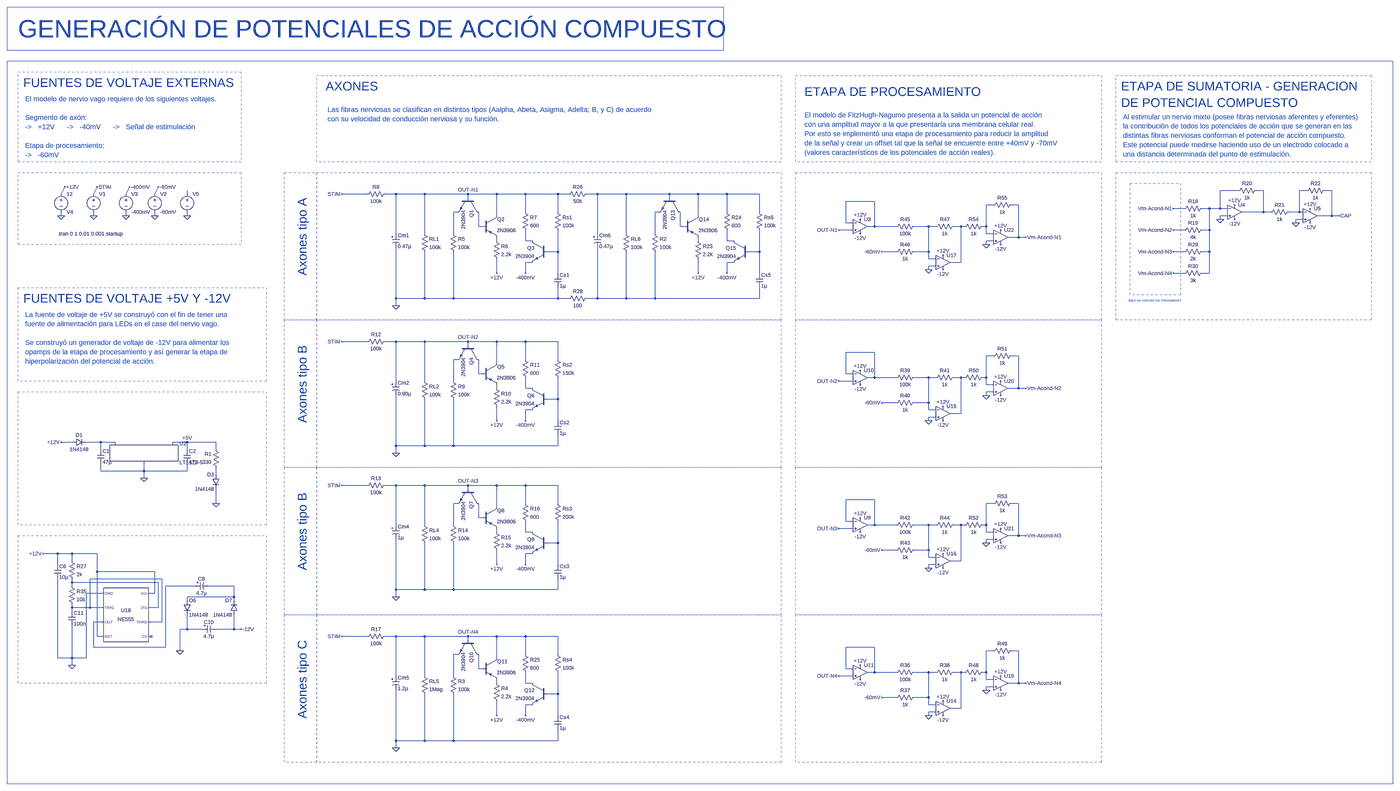
[diagram p0: schematic Compound-Action-Potential.asc, whole sheet]
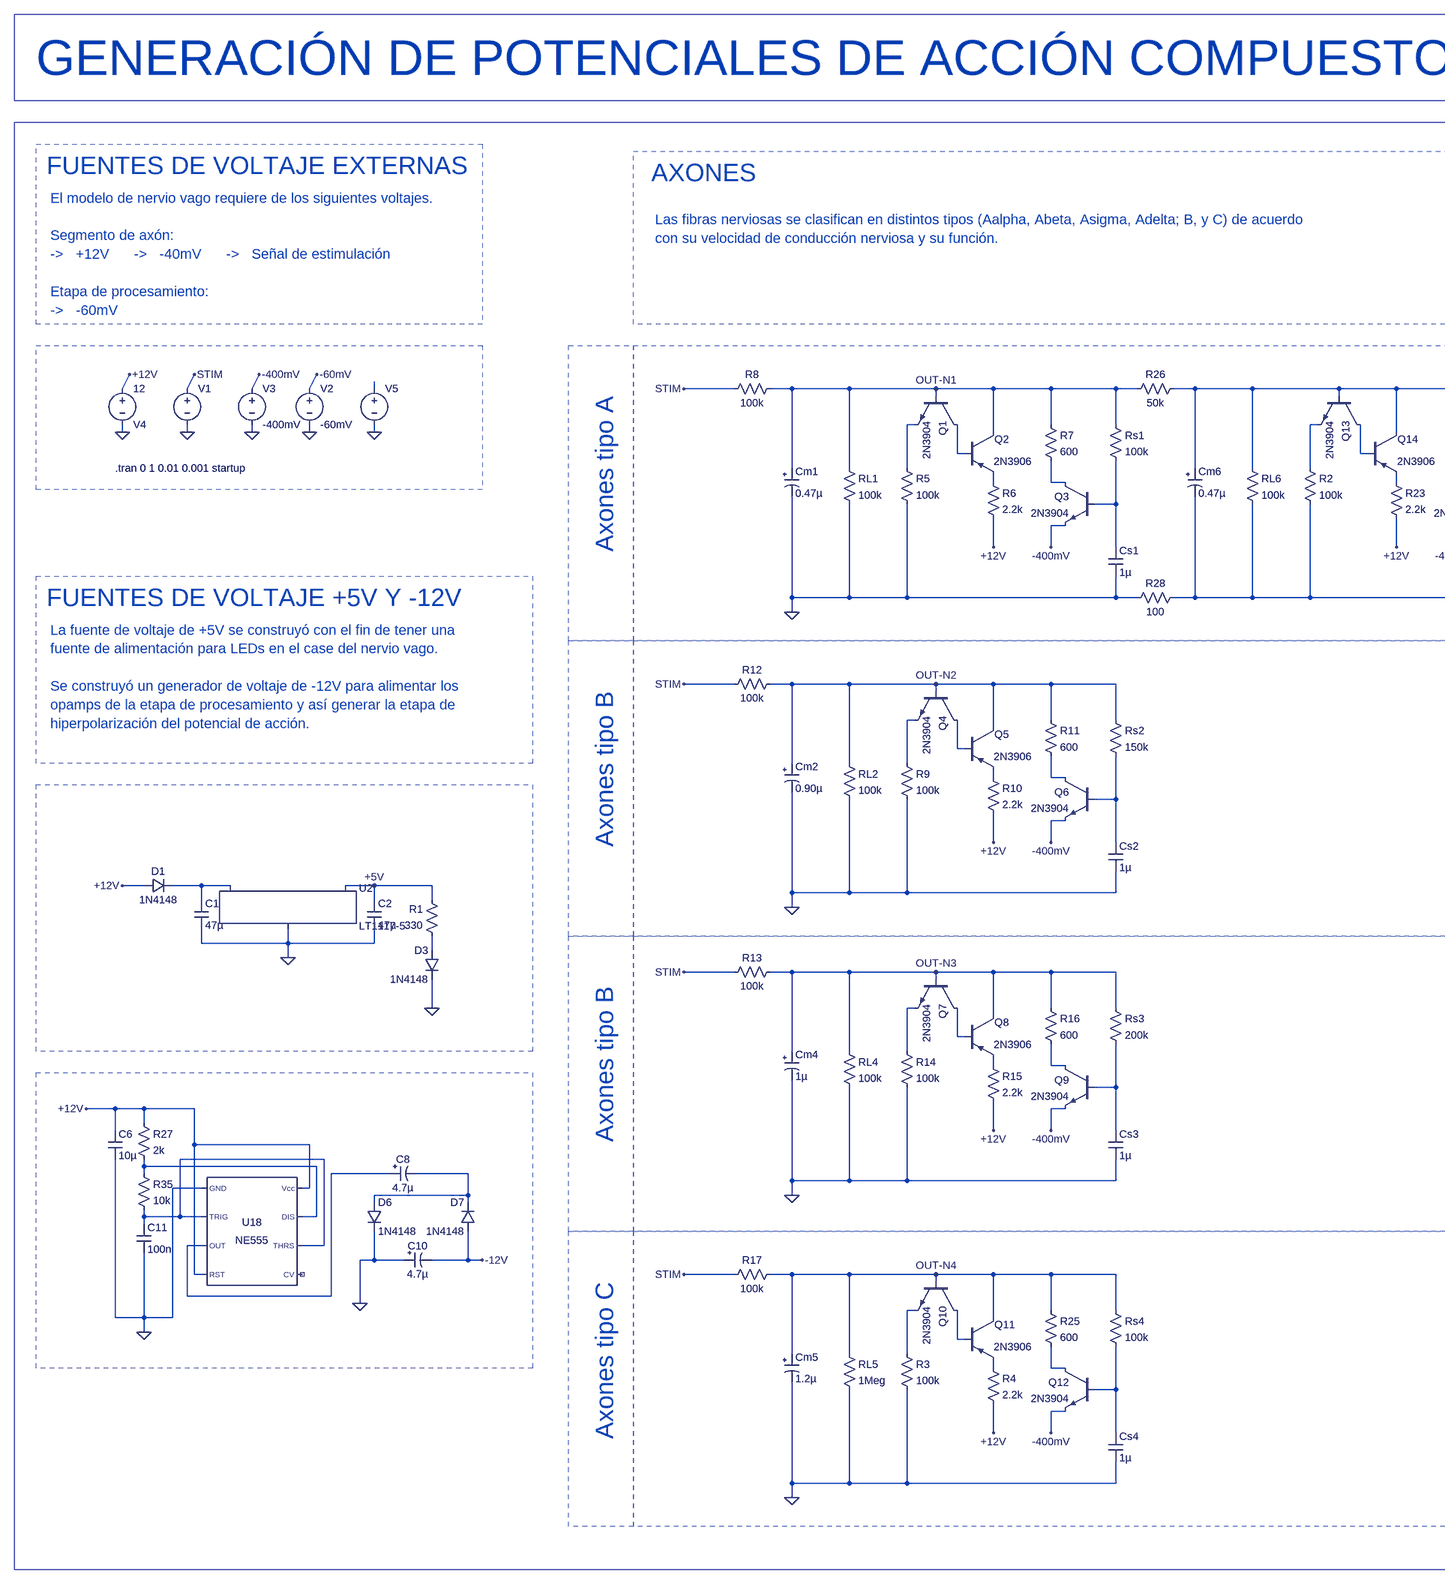
[diagram p1: schematic Compound-Action-Potential.asc, part, row 1 of 1, column 1 of 2]
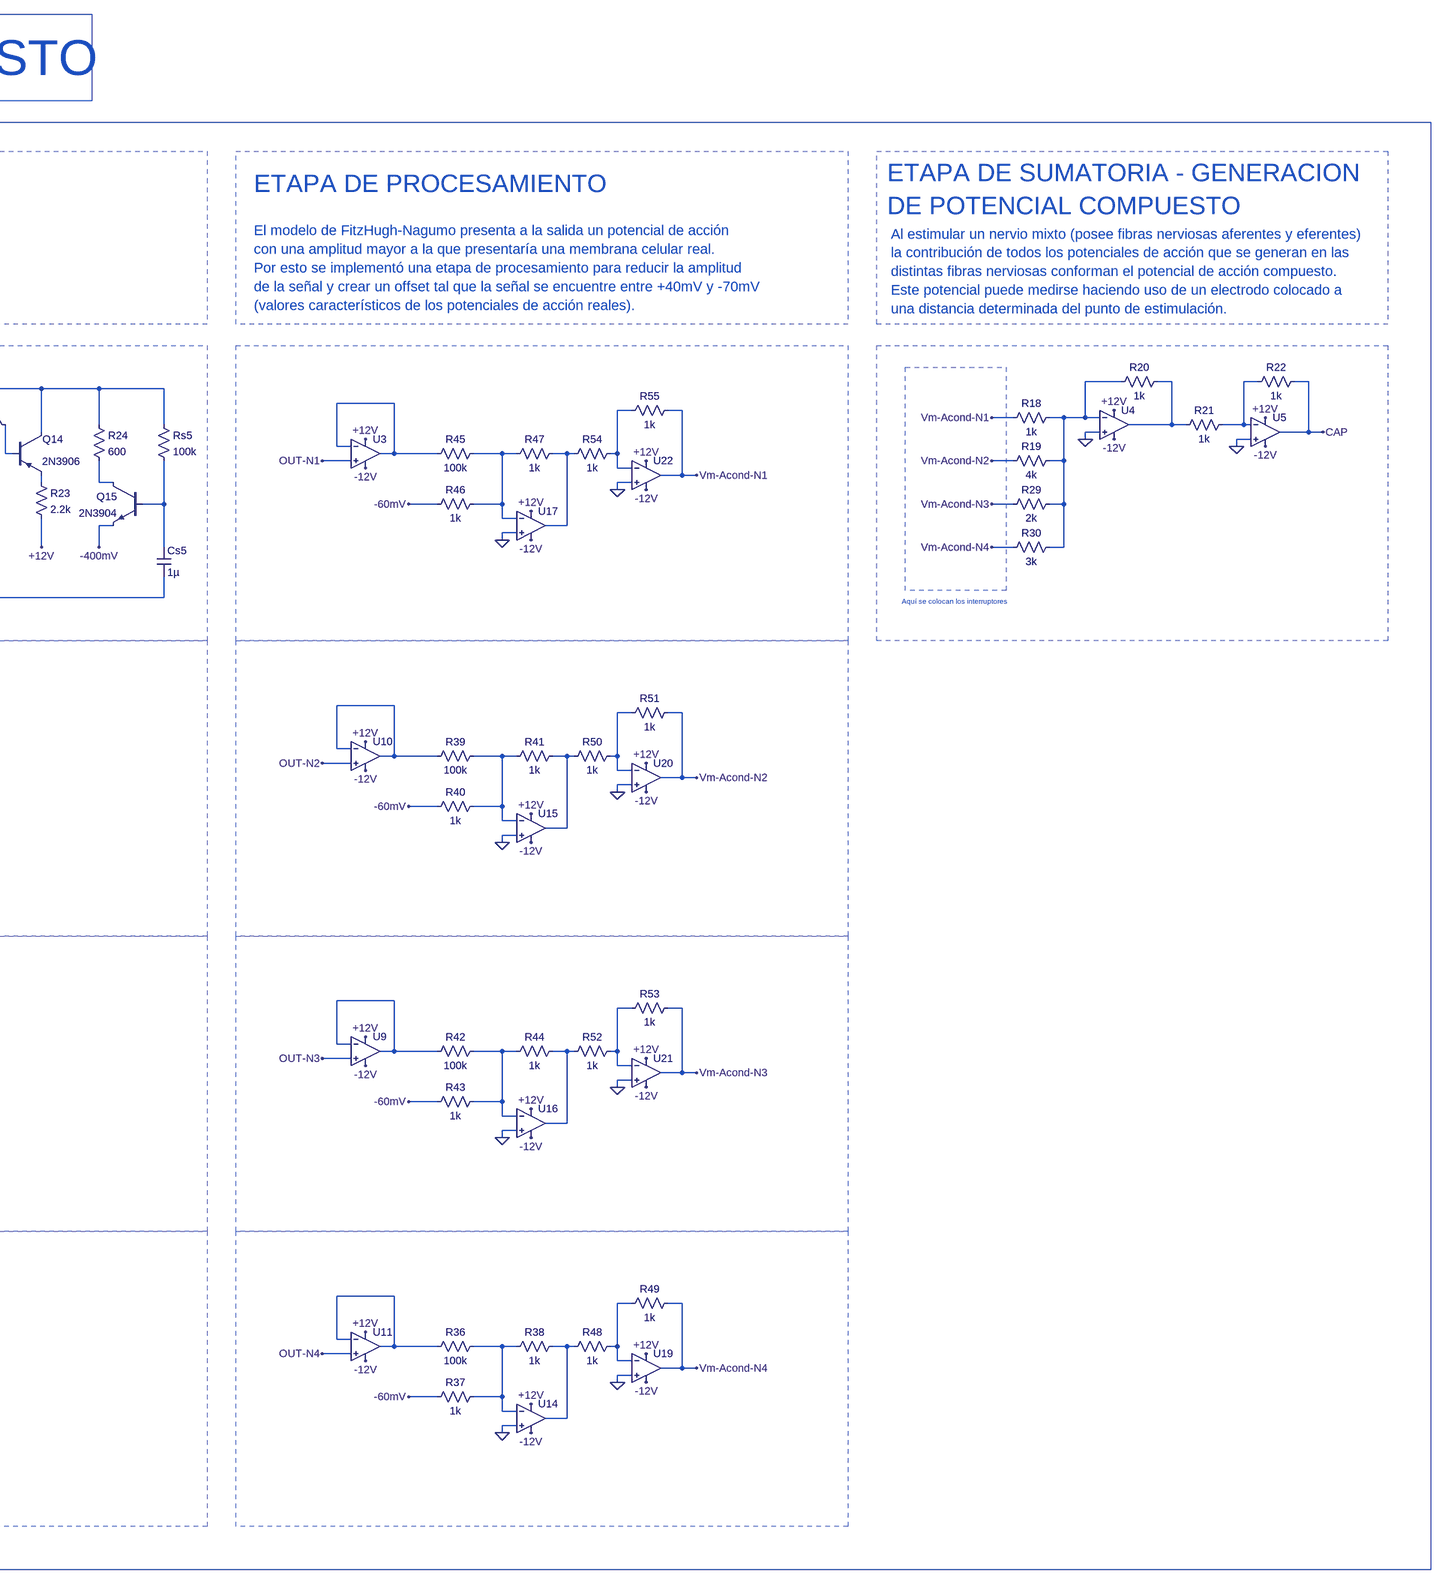
[diagram p2: schematic Compound-Action-Potential.asc, part, row 1 of 1, column 2 of 2]
Compound-Action-Potential.asc, the LTspice schematic file:
Version 4
SHEET 1 6660 4644
WIRE 4304 1152 4224 1152
WIRE 4416 1152 4384 1152
WIRE 4608 1152 4576 1152
WIRE 4720 1152 4688 1152
WIRE -928 1168 -912 1136
WIRE -784 1168 -768 1136
WIRE -640 1168 -624 1136
WIRE -512 1168 -496 1136
WIRE -368 1168 -368 1152
WIRE 432 1168 320 1168
WIRE 560 1168 512 1168
WIRE 688 1168 560 1168
WIRE 880 1168 688 1168
WIRE 1008 1168 880 1168
WIRE 1136 1168 1008 1168
WIRE 1280 1168 1136 1168
WIRE 1328 1168 1280 1168
WIRE 1456 1168 1408 1168
WIRE 1584 1168 1456 1168
WIRE 1776 1168 1584 1168
WIRE 1904 1168 1776 1168
WIRE 2032 1168 1904 1168
WIRE 2176 1168 2032 1168
WIRE 880 1184 880 1168
WIRE 1776 1184 1776 1168
WIRE 2688 1200 2560 1200
WIRE 3216 1216 3184 1216
WIRE 3328 1216 3296 1216
WIRE 4064 1232 4016 1232
WIRE 4176 1232 4144 1232
WIRE 4224 1232 4224 1152
WIRE 4224 1232 4176 1232
WIRE 4256 1232 4224 1232
WIRE 832 1248 816 1248
WIRE 1136 1248 1136 1168
WIRE 1280 1248 1280 1168
WIRE 1728 1248 1712 1248
WIRE 2032 1248 2032 1168
WIRE 2176 1248 2176 1168
WIRE 4416 1248 4416 1152
WIRE 4416 1248 4320 1248
WIRE 4448 1248 4416 1248
WIRE 4576 1248 4576 1152
WIRE 4576 1248 4528 1248
WIRE 4592 1248 4576 1248
WIRE -928 1264 -928 1248
WIRE -784 1264 -784 1248
WIRE -640 1264 -640 1248
WIRE -512 1264 -512 1248
WIRE -368 1264 -368 1248
WIRE 1008 1264 1008 1168
WIRE 1904 1264 1904 1168
WIRE 4256 1264 4224 1264
WIRE 4720 1264 4720 1152
WIRE 4720 1264 4656 1264
WIRE 4752 1264 4720 1264
WIRE 4224 1280 4224 1264
WIRE 4592 1280 4560 1280
WIRE 2560 1296 2560 1200
WIRE 2592 1296 2560 1296
WIRE 4560 1296 4560 1280
WIRE 928 1312 928 1248
WIRE 944 1312 928 1312
WIRE 1824 1312 1824 1248
WIRE 1840 1312 1824 1312
WIRE 2688 1312 2688 1200
WIRE 2688 1312 2656 1312
WIRE 2784 1312 2688 1312
WIRE 2928 1312 2864 1312
WIRE 2960 1312 2928 1312
WIRE 3072 1312 3040 1312
WIRE 3088 1312 3072 1312
WIRE 3184 1312 3184 1216
WIRE 3184 1312 3168 1312
WIRE 2592 1328 2528 1328
WIRE 4064 1328 4016 1328
WIRE 4176 1328 4176 1232
WIRE 4176 1328 4144 1328
WIRE 560 1344 560 1168
WIRE 688 1344 688 1168
WIRE 816 1344 816 1248
WIRE 1456 1344 1456 1168
WIRE 1584 1344 1584 1168
WIRE 1712 1344 1712 1248
WIRE 3184 1344 3184 1312
WIRE 3216 1344 3184 1344
WIRE 3328 1360 3328 1216
WIRE 3328 1360 3280 1360
WIRE 3360 1360 3328 1360
WIRE 1008 1376 1008 1360
WIRE 1136 1376 1136 1328
WIRE 1168 1376 1136 1376
WIRE 1904 1376 1904 1360
WIRE 2032 1376 2032 1328
WIRE 2064 1376 2032 1376
WIRE 3216 1376 3184 1376
WIRE 3184 1392 3184 1376
WIRE 1280 1424 1280 1328
WIRE 1280 1424 1232 1424
WIRE 2176 1424 2176 1328
WIRE 2176 1424 2128 1424
WIRE 2784 1424 2720 1424
WIRE 2928 1424 2928 1312
WIRE 2928 1424 2864 1424
WIRE 4064 1424 4016 1424
WIRE 4176 1424 4176 1328
WIRE 4176 1424 4144 1424
WIRE 2928 1456 2928 1424
WIRE 2960 1456 2928 1456
WIRE 1168 1472 1136 1472
WIRE 2064 1472 2032 1472
WIRE 3072 1472 3072 1312
WIRE 3072 1472 3024 1472
WIRE 2960 1488 2928 1488
WIRE 2928 1504 2928 1488
WIRE 1008 1520 1008 1456
WIRE 1136 1520 1136 1472
WIRE 1280 1520 1280 1424
WIRE 1904 1520 1904 1456
WIRE 2032 1520 2032 1472
WIRE 2176 1520 2176 1424
WIRE 4064 1520 4016 1520
WIRE 4176 1520 4176 1424
WIRE 4176 1520 4144 1520
WIRE 560 1632 560 1408
WIRE 688 1632 688 1424
WIRE 688 1632 560 1632
WIRE 816 1632 816 1424
WIRE 816 1632 688 1632
WIRE 1280 1632 1280 1584
WIRE 1280 1632 816 1632
WIRE 1328 1632 1280 1632
WIRE 1456 1632 1456 1408
WIRE 1456 1632 1408 1632
WIRE 1584 1632 1584 1424
WIRE 1584 1632 1456 1632
WIRE 1712 1632 1712 1424
WIRE 1712 1632 1584 1632
WIRE 2176 1632 2176 1584
WIRE 2176 1632 1712 1632
WIRE 560 1664 560 1632
WIRE 432 1824 320 1824
WIRE 560 1824 512 1824
WIRE 688 1824 560 1824
WIRE 880 1824 688 1824
WIRE 1008 1824 880 1824
WIRE 1136 1824 1008 1824
WIRE 1280 1824 1136 1824
WIRE 880 1840 880 1824
WIRE 2688 1872 2560 1872
WIRE 3216 1888 3184 1888
WIRE 3328 1888 3296 1888
WIRE 832 1904 816 1904
WIRE 1136 1904 1136 1824
WIRE 1280 1904 1280 1824
WIRE 1008 1920 1008 1824
WIRE 928 1968 928 1904
WIRE 944 1968 928 1968
WIRE 2560 1968 2560 1872
WIRE 2592 1968 2560 1968
WIRE 2688 1984 2688 1872
WIRE 2688 1984 2656 1984
WIRE 2784 1984 2688 1984
WIRE 2928 1984 2864 1984
WIRE 2960 1984 2928 1984
WIRE 3072 1984 3040 1984
WIRE 3088 1984 3072 1984
WIRE 3184 1984 3184 1888
WIRE 3184 1984 3168 1984
WIRE 560 2000 560 1824
WIRE 688 2000 688 1824
WIRE 816 2000 816 1904
WIRE 2592 2000 2528 2000
WIRE 3184 2016 3184 1984
WIRE 3216 2016 3184 2016
WIRE 1008 2032 1008 2016
WIRE 1136 2032 1136 1984
WIRE 1168 2032 1136 2032
WIRE 3328 2032 3328 1888
WIRE 3328 2032 3280 2032
WIRE 3360 2032 3328 2032
WIRE 3216 2048 3184 2048
WIRE 3184 2064 3184 2048
WIRE 1280 2080 1280 1984
WIRE 1280 2080 1232 2080
WIRE 2784 2096 2720 2096
WIRE 2928 2096 2928 1984
WIRE 2928 2096 2864 2096
WIRE 1168 2128 1136 2128
WIRE 2928 2128 2928 2096
WIRE 2960 2128 2928 2128
WIRE 3072 2144 3072 1984
WIRE 3072 2144 3024 2144
WIRE 2960 2160 2928 2160
WIRE 1008 2176 1008 2112
WIRE 1136 2176 1136 2128
WIRE 1280 2176 1280 2080
WIRE 2928 2176 2928 2160
WIRE -880 2272 -928 2272
WIRE -752 2272 -816 2272
WIRE -688 2272 -752 2272
WIRE -368 2272 -432 2272
WIRE -240 2272 -368 2272
WIRE 560 2288 560 2064
WIRE 688 2288 688 2080
WIRE 688 2288 560 2288
WIRE 816 2288 816 2080
WIRE 816 2288 688 2288
WIRE 1280 2288 1280 2240
WIRE 1280 2288 816 2288
WIRE -752 2304 -752 2272
WIRE -368 2304 -368 2272
WIRE -240 2304 -240 2272
WIRE 560 2320 560 2288
WIRE -752 2400 -752 2368
WIRE -560 2400 -560 2368
WIRE -560 2400 -752 2400
WIRE -368 2400 -368 2368
WIRE -368 2400 -560 2400
WIRE -240 2416 -240 2384
WIRE -560 2432 -560 2400
WIRE 432 2464 320 2464
WIRE 560 2464 512 2464
WIRE 688 2464 560 2464
WIRE 880 2464 688 2464
WIRE 1008 2464 880 2464
WIRE 1136 2464 1008 2464
WIRE 1280 2464 1136 2464
WIRE 880 2480 880 2464
WIRE 2688 2528 2560 2528
WIRE -240 2544 -240 2480
WIRE 832 2544 816 2544
WIRE 1136 2544 1136 2464
WIRE 1280 2544 1280 2464
WIRE 3216 2544 3184 2544
WIRE 3328 2544 3296 2544
WIRE 1008 2560 1008 2464
WIRE 928 2608 928 2544
WIRE 944 2608 928 2608
WIRE 2560 2624 2560 2528
WIRE 2592 2624 2560 2624
WIRE 560 2640 560 2464
WIRE 688 2640 688 2464
WIRE 816 2640 816 2544
WIRE 2688 2640 2688 2528
WIRE 2688 2640 2656 2640
WIRE 2784 2640 2688 2640
WIRE 2928 2640 2864 2640
WIRE 2960 2640 2928 2640
WIRE 3072 2640 3040 2640
WIRE 3088 2640 3072 2640
WIRE 3184 2640 3184 2544
WIRE 3184 2640 3168 2640
WIRE 2592 2656 2528 2656
WIRE 1008 2672 1008 2656
WIRE 1136 2672 1136 2624
WIRE 1168 2672 1136 2672
WIRE 3184 2672 3184 2640
WIRE 3216 2672 3184 2672
WIRE 3328 2688 3328 2544
WIRE 3328 2688 3280 2688
WIRE 3360 2688 3328 2688
WIRE 3216 2704 3184 2704
WIRE 1280 2720 1280 2624
WIRE 1280 2720 1232 2720
WIRE 3184 2720 3184 2704
WIRE 2784 2752 2720 2752
WIRE 2928 2752 2928 2640
WIRE 2928 2752 2864 2752
WIRE -944 2768 -1008 2768
WIRE -880 2768 -944 2768
WIRE -768 2768 -880 2768
WIRE 1168 2768 1136 2768
WIRE 2928 2784 2928 2752
WIRE 2960 2784 2928 2784
WIRE -880 2800 -880 2768
WIRE 3072 2800 3072 2640
WIRE 3072 2800 3024 2800
WIRE -944 2816 -944 2768
WIRE 1008 2816 1008 2752
WIRE 1136 2816 1136 2768
WIRE 1280 2816 1280 2720
WIRE 2960 2816 2928 2816
WIRE 2928 2832 2928 2816
WIRE -768 2848 -768 2768
WIRE -512 2848 -768 2848
WIRE -480 2880 -800 2880
WIRE -880 2896 -880 2880
WIRE -496 2896 -880 2896
WIRE -880 2912 -880 2896
WIRE -336 2912 -464 2912
WIRE -160 2912 -272 2912
WIRE 560 2928 560 2704
WIRE 688 2928 688 2720
WIRE 688 2928 560 2928
WIRE 816 2928 816 2720
WIRE 816 2928 688 2928
WIRE 1280 2928 1280 2880
WIRE 1280 2928 816 2928
WIRE -752 2944 -816 2944
WIRE -512 2944 -512 2848
WIRE -512 2944 -528 2944
WIRE -160 2960 -160 2912
WIRE -160 2960 -368 2960
WIRE 560 2960 560 2928
WIRE -368 2976 -368 2960
WIRE -160 2976 -160 2960
WIRE -880 3008 -880 2992
WIRE -800 3008 -800 2880
WIRE -800 3008 -880 3008
WIRE -752 3008 -800 3008
WIRE -496 3008 -496 2896
WIRE -496 3008 -528 3008
WIRE -880 3024 -880 3008
WIRE -752 3072 -784 3072
WIRE -480 3072 -480 2880
WIRE -480 3072 -528 3072
WIRE -368 3104 -368 3040
WIRE -368 3104 -400 3104
WIRE -304 3104 -368 3104
WIRE -160 3104 -160 3040
WIRE -160 3104 -240 3104
WIRE -128 3104 -160 3104
WIRE -768 3136 -768 2848
WIRE -752 3136 -768 3136
WIRE 432 3136 320 3136
WIRE 560 3136 512 3136
WIRE 688 3136 560 3136
WIRE 880 3136 688 3136
WIRE 1008 3136 880 3136
WIRE 1136 3136 1008 3136
WIRE 1280 3136 1136 3136
WIRE 880 3152 880 3136
WIRE -784 3184 -784 3072
WIRE -464 3184 -464 2912
WIRE -464 3184 -784 3184
WIRE 2688 3184 2560 3184
WIRE -400 3200 -400 3104
WIRE 3216 3200 3184 3200
WIRE 3328 3200 3296 3200
WIRE 832 3216 816 3216
WIRE 1136 3216 1136 3136
WIRE 1280 3216 1280 3136
WIRE -944 3232 -944 2880
WIRE -880 3232 -880 3088
WIRE -880 3232 -944 3232
WIRE -816 3232 -816 2944
WIRE -816 3232 -880 3232
WIRE 1008 3232 1008 3136
WIRE -880 3264 -880 3232
WIRE 928 3280 928 3216
WIRE 944 3280 928 3280
WIRE 2560 3280 2560 3184
WIRE 2592 3280 2560 3280
WIRE 2688 3296 2688 3184
WIRE 2688 3296 2656 3296
WIRE 2784 3296 2688 3296
WIRE 2928 3296 2864 3296
WIRE 2960 3296 2928 3296
WIRE 3072 3296 3040 3296
WIRE 3088 3296 3072 3296
WIRE 3184 3296 3184 3200
WIRE 3184 3296 3168 3296
WIRE 560 3312 560 3136
WIRE 688 3312 688 3136
WIRE 816 3312 816 3216
WIRE 2592 3312 2528 3312
WIRE 3184 3328 3184 3296
WIRE 3216 3328 3184 3328
WIRE 1008 3344 1008 3328
WIRE 1136 3344 1136 3296
WIRE 1168 3344 1136 3344
WIRE 3328 3344 3328 3200
WIRE 3328 3344 3280 3344
WIRE 3360 3344 3328 3344
WIRE 3216 3360 3184 3360
WIRE 3184 3376 3184 3360
WIRE 1280 3392 1280 3296
WIRE 1280 3392 1232 3392
WIRE 2784 3408 2720 3408
WIRE 2928 3408 2928 3296
WIRE 2928 3408 2864 3408
WIRE 1168 3440 1136 3440
WIRE 2928 3440 2928 3408
WIRE 2960 3440 2928 3440
WIRE 3072 3456 3072 3296
WIRE 3072 3456 3024 3456
WIRE 2960 3472 2928 3472
WIRE 1008 3488 1008 3424
WIRE 1136 3488 1136 3440
WIRE 1280 3488 1280 3392
WIRE 2928 3488 2928 3472
WIRE 560 3600 560 3376
WIRE 688 3600 688 3392
WIRE 688 3600 560 3600
WIRE 816 3600 816 3392
WIRE 816 3600 688 3600
WIRE 1280 3600 1280 3552
WIRE 1280 3600 816 3600
WIRE 560 3632 560 3600
FLAG -560 2432 0
FLAG -240 2544 0
FLAG -368 2272 +5V
FLAG 560 1664 0
FLAG -640 1264 0
FLAG -624 1136 -400mV
FLAG -928 2272 +12V
FLAG 1008 1520 +12V
FLAG 1136 1520 -400mV
FLAG -368 1264 0
FLAG 560 2320 0
FLAG 1008 2176 +12V
FLAG 1136 2176 -400mV
FLAG 880 1168 OUT-N1
FLAG 880 1824 OUT-N2
FLAG 560 2960 0
FLAG 1008 2816 +12V
FLAG 1136 2816 -400mV
FLAG 880 2464 OUT-N3
FLAG 4224 1280 0
FLAG -912 1136 +12V
FLAG 4288 1216 +12V
FLAG 4288 1280 -12V
FLAG 4624 1232 +12V
FLAG 4624 1296 -12V
FLAG 4560 1296 0
FLAG 4752 1264 CAP
FLAG 2624 1344 -12V
FLAG 2624 1280 +12V
FLAG 2528 1328 OUT-N1
FLAG 2624 2672 -12V
FLAG 2624 2608 +12V
FLAG 2528 2656 OUT-N3
FLAG 2624 2016 -12V
FLAG 2624 1952 +12V
FLAG 2528 2000 OUT-N2
FLAG 2624 3328 -12V
FLAG 2624 3264 +12V
FLAG 2528 3312 OUT-N4
FLAG 560 3632 0
FLAG 1008 3488 +12V
FLAG 1136 3488 -400mV
FLAG 880 3136 OUT-N4
FLAG -784 1264 0
FLAG -768 1136 STIM
FLAG 2928 3488 0
FLAG 2928 2176 0
FLAG 2928 2832 0
FLAG 2928 1504 0
FLAG 2992 3424 +12V
FLAG 2992 2112 +12V
FLAG 2992 2768 +12V
FLAG 2992 1440 +12V
FLAG 2992 3488 -12V
FLAG 2992 2176 -12V
FLAG 2992 2832 -12V
FLAG 2992 1504 -12V
FLAG 3184 3376 0
FLAG 3248 3312 +12V
FLAG 3248 3376 -12V
FLAG 3184 2064 0
FLAG 3248 2000 +12V
FLAG 3248 2064 -12V
FLAG 3184 2720 0
FLAG 3248 2656 +12V
FLAG 3248 2720 -12V
FLAG 3184 1392 0
FLAG 3248 1328 +12V
FLAG 3248 1392 -12V
FLAG -880 3264 0
FLAG -400 3200 0
FLAG -1008 2768 +12V
FLAG 2720 1424 -60mV
FLAG 2720 2752 -60mV
FLAG 2720 2096 -60mV
FLAG 2720 3408 -60mV
FLAG 3360 1360 Vm-Acond-N1
FLAG 3360 2032 Vm-Acond-N2
FLAG 3360 2688 Vm-Acond-N3
FLAG 3360 3344 Vm-Acond-N4
FLAG 4016 1232 Vm-Acond-N1
FLAG 4016 1328 Vm-Acond-N2
FLAG 4016 1424 Vm-Acond-N3
FLAG 4016 1520 Vm-Acond-N4
FLAG -928 1264 0
FLAG -512 1264 0
FLAG -496 1136 -60mV
FLAG -128 3104 -12V
FLAG 320 1168 STIM
FLAG 320 1824 STIM
FLAG 320 2464 STIM
FLAG 320 3136 STIM
FLAG 1904 1520 +12V
FLAG 2032 1520 -400mV
SYMBOL PowerProducts\\LT1117-5 -560 2272 R0
SYMATTR InstName U2
SYMBOL diode -880 2288 R270
WINDOW 0 32 32 VTop 2
WINDOW 3 0 32 VBottom 2
SYMATTR InstName D1
SYMATTR Value 1N4148
SYMBOL diode -224 2416 M0
SYMATTR InstName D3
SYMATTR Value 1N4148
SYMBOL res -224 2400 R180
WINDOW 0 36 76 Left 2
WINDOW 3 36 40 Left 2
SYMATTR InstName R1
SYMATTR Value 330
SYMBOL res 672 1328 R0
SYMATTR InstName RL1
SYMATTR Value 100k
SYMBOL res 800 1328 R0
SYMATTR InstName R5
SYMATTR Value 100k
SYMBOL res 992 1360 R0
SYMATTR InstName R6
SYMATTR Value 2.2k
SYMBOL res 1264 1232 R0
SYMATTR InstName Rs1
SYMATTR Value 100k
SYMBOL cap 1264 1520 R0
SYMATTR InstName Cs1
SYMATTR Value 1µ
SYMBOL npn 928 1184 R90
SYMATTR InstName Q1
SYMATTR Value 2N3904
SYMBOL pnp 944 1264 R0
WINDOW 0 66 16 Left 2
WINDOW 3 65 65 Left 2
SYMATTR InstName Q2
SYMATTR Value 2N3906
SYMBOL npn 1232 1376 M0
SYMATTR InstName Q3
SYMATTR Value 2N3904
SYMBOL polcap 544 1344 R0
SYMATTR InstName Cm1
SYMATTR Value 0.47µ
SYMBOL res 1120 1232 R0
SYMATTR InstName R7
SYMATTR Value 600
SYMBOL voltage -640 1152 R0
WINDOW 123 0 0 Left 0
WINDOW 39 0 0 Left 0
SYMATTR InstName V3
SYMATTR Value -400mV
SYMBOL cap -768 2304 R0
SYMATTR InstName C1
SYMATTR Value 47µ
SYMBOL cap -384 2304 R0
SYMATTR InstName C2
SYMATTR Value 47µ
SYMBOL voltage -368 1152 R0
WINDOW 123 0 0 Left 0
WINDOW 39 0 0 Left 0
WINDOW 3 24 44 Invisible 2
SYMATTR Value PWL(0 0 5m 0 5.0000001m 0.5 15m 0.5 15.000001m 0 70m 0 70.000001m 1 80m 1 80.000001m 0 135m 0 135.000001m 2 145m 2 145.000001m 0 200m 0 200.000001m 3 210m 3 210.000001m 0 265m 0 265.000001m 4 275m 4 275.000001m 0 330m 0 330.00001m 5 340m 5 340.000001m 0)
SYMATTR InstName V5
SYMBOL res 672 1984 R0
SYMATTR InstName RL2
SYMATTR Value 100k
SYMBOL res 800 1984 R0
SYMATTR InstName R9
SYMATTR Value 100k
SYMBOL res 992 2016 R0
SYMATTR InstName R10
SYMATTR Value 2.2k
SYMBOL res 1264 1888 R0
SYMATTR InstName Rs2
SYMATTR Value 150k
SYMBOL cap 1264 2176 R0
SYMATTR InstName Cs2
SYMATTR Value 1µ
SYMBOL npn 928 1840 R90
SYMATTR InstName Q4
SYMATTR Value 2N3904
SYMBOL pnp 944 1920 R0
WINDOW 0 66 16 Left 2
WINDOW 3 65 65 Left 2
SYMATTR InstName Q5
SYMATTR Value 2N3906
SYMBOL npn 1232 2032 M0
SYMATTR InstName Q6
SYMATTR Value 2N3904
SYMBOL polcap 544 2000 R0
SYMATTR InstName Cm2
SYMATTR Value 0.90µ
SYMBOL res 1120 1888 R0
SYMATTR InstName R11
SYMATTR Value 600
SYMBOL res 672 2624 R0
SYMATTR InstName RL4
SYMATTR Value 100k
SYMBOL res 800 2624 R0
SYMATTR InstName R14
SYMATTR Value 100k
SYMBOL res 992 2656 R0
SYMATTR InstName R15
SYMATTR Value 2.2k
SYMBOL res 1264 2528 R0
SYMATTR InstName Rs3
SYMATTR Value 200k
SYMBOL cap 1264 2816 R0
SYMATTR InstName Cs3
SYMATTR Value 1µ
SYMBOL npn 928 2480 R90
SYMATTR InstName Q7
SYMATTR Value 2N3904
SYMBOL pnp 944 2560 R0
WINDOW 0 66 16 Left 2
WINDOW 3 65 65 Left 2
SYMATTR InstName Q8
SYMATTR Value 2N3906
SYMBOL npn 1232 2672 M0
SYMATTR InstName Q9
SYMATTR Value 2N3904
SYMBOL polcap 544 2640 R0
SYMATTR InstName Cm4
SYMATTR Value 1µ
SYMBOL res 1120 2528 R0
SYMATTR InstName R16
SYMATTR Value 600
SYMBOL res 4160 1216 R90
WINDOW 0 0 56 VBottom 2
WINDOW 3 32 56 VTop 2
SYMATTR InstName R18
SYMATTR Value 1k
SYMBOL res 4160 1312 R90
WINDOW 0 0 56 VBottom 2
WINDOW 3 32 56 VTop 2
SYMATTR InstName R19
SYMATTR Value 4k
SYMBOL res 4400 1136 R90
WINDOW 0 0 56 VBottom 2
WINDOW 3 32 56 VTop 2
SYMATTR InstName R20
SYMATTR Value 1k
SYMBOL OpAmps\\UniversalOpAmp2 4288 1248 R0
SYMATTR InstName U4
SYMBOL voltage -928 1152 R0
WINDOW 0 24 96 Left 2
WINDOW 3 24 16 Left 2
WINDOW 123 0 0 Left 0
WINDOW 39 0 0 Left 0
SYMATTR InstName V4
SYMATTR Value 12
SYMBOL OpAmps\\UniversalOpAmp2 4624 1264 R0
SYMATTR InstName U5
SYMBOL res 4544 1232 R90
WINDOW 0 0 56 VBottom 2
WINDOW 3 32 56 VTop 2
SYMATTR InstName R21
SYMATTR Value 1k
SYMBOL res 4704 1136 R90
WINDOW 0 0 56 VBottom 2
WINDOW 3 32 56 VTop 2
SYMATTR InstName R22
SYMATTR Value 1k
SYMBOL res 4160 1408 R90
WINDOW 0 0 56 VBottom 2
WINDOW 3 32 56 VTop 2
SYMATTR InstName R29
SYMATTR Value 2k
SYMBOL res 4160 1504 R90
WINDOW 0 0 56 VBottom 2
WINDOW 3 32 56 VTop 2
SYMATTR InstName R30
SYMATTR Value 3k
SYMBOL OpAmps\\UniversalOpAmp2 2624 1312 R0
SYMATTR InstName U3
SYMBOL OpAmps\\UniversalOpAmp2 2624 2640 R0
SYMATTR InstName U9
SYMBOL OpAmps\\UniversalOpAmp2 2624 1984 R0
SYMATTR InstName U10
SYMBOL OpAmps\\UniversalOpAmp2 2624 3296 R0
SYMATTR InstName U11
SYMBOL res 672 3296 R0
SYMATTR InstName RL5
SYMATTR Value 1Meg
SYMBOL res 800 3296 R0
SYMATTR InstName R3
SYMATTR Value 100k
SYMBOL res 992 3328 R0
SYMATTR InstName R4
SYMATTR Value 2.2k
SYMBOL res 1264 3200 R0
SYMATTR InstName Rs4
SYMATTR Value 100k
SYMBOL cap 1264 3488 R0
SYMATTR InstName Cs4
SYMATTR Value 1µ
SYMBOL npn 928 3152 R90
SYMATTR InstName Q10
SYMATTR Value 2N3904
SYMBOL pnp 944 3232 R0
WINDOW 0 66 16 Left 2
WINDOW 3 65 65 Left 2
SYMATTR InstName Q11
SYMATTR Value 2N3906
SYMBOL npn 1232 3344 M0
SYMATTR InstName Q12
SYMATTR Value 2N3904
SYMBOL polcap 544 3312 R0
SYMATTR InstName Cm5
SYMATTR Value 1.2µ
SYMBOL res 1120 3200 R0
SYMATTR InstName R25
SYMATTR Value 600
SYMBOL voltage -784 1152 R0
WINDOW 123 0 0 Left 0
WINDOW 39 0 0 Left 0
WINDOW 3 24 44 Invisible 2
SYMATTR Value PULSE(0 5 0 1f 1f 10m 140m 0)
SYMATTR InstName V1
SYMBOL OpAmps\\UniversalOpAmp 2992 3456 R0
SYMATTR InstName U14
SYMBOL res 2880 3280 R90
WINDOW 0 0 56 VBottom 2
WINDOW 3 32 56 VTop 2
SYMATTR InstName R36
SYMATTR Value 100k
SYMBOL res 2880 3392 R90
WINDOW 0 0 56 VBottom 2
WINDOW 3 32 56 VTop 2
SYMATTR InstName R37
SYMATTR Value 1k
SYMBOL res 3056 3280 R90
WINDOW 0 0 56 VBottom 2
WINDOW 3 32 56 VTop 2
SYMATTR InstName R38
SYMATTR Value 1k
SYMBOL OpAmps\\UniversalOpAmp 2992 2144 R0
SYMATTR InstName U15
SYMBOL res 2880 1968 R90
WINDOW 0 0 56 VBottom 2
WINDOW 3 32 56 VTop 2
SYMATTR InstName R39
SYMATTR Value 100k
SYMBOL res 2880 2080 R90
WINDOW 0 0 56 VBottom 2
WINDOW 3 32 56 VTop 2
SYMATTR InstName R40
SYMATTR Value 1k
SYMBOL res 3056 1968 R90
WINDOW 0 0 56 VBottom 2
WINDOW 3 32 56 VTop 2
SYMATTR InstName R41
SYMATTR Value 1k
SYMBOL OpAmps\\UniversalOpAmp 2992 2800 R0
SYMATTR InstName U16
SYMBOL res 2880 2624 R90
WINDOW 0 0 56 VBottom 2
WINDOW 3 32 56 VTop 2
SYMATTR InstName R42
SYMATTR Value 100k
SYMBOL res 2880 2736 R90
WINDOW 0 0 56 VBottom 2
WINDOW 3 32 56 VTop 2
SYMATTR InstName R43
SYMATTR Value 1k
SYMBOL res 3056 2624 R90
WINDOW 0 0 56 VBottom 2
WINDOW 3 32 56 VTop 2
SYMATTR InstName R44
SYMATTR Value 1k
SYMBOL OpAmps\\UniversalOpAmp 2992 1472 R0
SYMATTR InstName U17
SYMBOL res 2880 1296 R90
WINDOW 0 0 56 VBottom 2
WINDOW 3 32 56 VTop 2
SYMATTR InstName R45
SYMATTR Value 100k
SYMBOL res 2880 1408 R90
WINDOW 0 0 56 VBottom 2
WINDOW 3 32 56 VTop 2
SYMATTR InstName R46
SYMATTR Value 1k
SYMBOL res 3056 1296 R90
WINDOW 0 0 56 VBottom 2
WINDOW 3 32 56 VTop 2
SYMATTR InstName R47
SYMATTR Value 1k
SYMBOL OpAmps\\UniversalOpAmp 3248 3344 R0
SYMATTR InstName U19
SYMBOL res 3184 3280 R90
WINDOW 0 0 56 VBottom 2
WINDOW 3 32 56 VTop 2
SYMATTR InstName R48
SYMATTR Value 1k
SYMBOL res 3312 3184 R90
WINDOW 0 0 56 VBottom 2
WINDOW 3 32 56 VTop 2
SYMATTR InstName R49
SYMATTR Value 1k
SYMBOL OpAmps\\UniversalOpAmp 3248 2032 R0
SYMATTR InstName U20
SYMBOL res 3184 1968 R90
WINDOW 0 0 56 VBottom 2
WINDOW 3 32 56 VTop 2
SYMATTR InstName R50
SYMATTR Value 1k
SYMBOL res 3312 1872 R90
WINDOW 0 0 56 VBottom 2
WINDOW 3 32 56 VTop 2
SYMATTR InstName R51
SYMATTR Value 1k
SYMBOL OpAmps\\UniversalOpAmp 3248 2688 R0
SYMATTR InstName U21
SYMBOL res 3184 2624 R90
WINDOW 0 0 56 VBottom 2
WINDOW 3 32 56 VTop 2
SYMATTR InstName R52
SYMATTR Value 1k
SYMBOL res 3312 2528 R90
WINDOW 0 0 56 VBottom 2
WINDOW 3 32 56 VTop 2
SYMATTR InstName R53
SYMATTR Value 1k
SYMBOL OpAmps\\UniversalOpAmp 3248 1360 R0
SYMATTR InstName U22
SYMBOL res 3184 1296 R90
WINDOW 0 0 56 VBottom 2
WINDOW 3 32 56 VTop 2
SYMATTR InstName R54
SYMATTR Value 1k
SYMBOL res 3312 1200 R90
WINDOW 0 0 56 VBottom 2
WINDOW 3 32 56 VTop 2
SYMATTR InstName R55
SYMATTR Value 1k
SYMBOL Misc\\NE555 -640 3040 R0
SYMATTR InstName U18
SYMBOL res -896 2784 R0
SYMATTR InstName R27
SYMATTR Value 2k
SYMBOL res -896 2896 R0
SYMATTR InstName R35
SYMATTR Value 10k
SYMBOL cap -960 2816 R0
SYMATTR InstName C6
SYMATTR Value 10µ
SYMBOL polcap -336 2896 M90
WINDOW 0 0 32 VBottom 2
WINDOW 3 32 32 VTop 2
SYMATTR InstName C8
SYMATTR Value 4.7µ
SYMBOL polcap -304 3088 M90
WINDOW 0 0 32 VBottom 2
WINDOW 3 32 32 VTop 2
SYMATTR InstName C10
SYMATTR Value 4.7µ
SYMBOL diode -384 2976 R0
SYMATTR InstName D6
SYMATTR Value 1N4148
SYMBOL diode -144 3040 R180
WINDOW 0 24 64 Left 2
WINDOW 3 24 0 Left 2
SYMATTR InstName D7
SYMATTR Value 1N4148
SYMBOL cap -896 3024 R0
SYMATTR InstName C11
SYMATTR Value 100n
SYMBOL voltage -512 1152 R0
WINDOW 123 0 0 Left 0
WINDOW 39 0 0 Left 0
SYMATTR InstName V2
SYMATTR Value -60mV
SYMBOL res 528 1152 R90
WINDOW 0 0 56 VBottom 2
WINDOW 3 32 56 VTop 2
SYMATTR InstName R8
SYMATTR Value 100k
SYMBOL res 528 1808 R90
WINDOW 0 0 56 VBottom 2
WINDOW 3 32 56 VTop 2
SYMATTR InstName R12
SYMATTR Value 100k
SYMBOL res 528 2448 R90
WINDOW 0 0 56 VBottom 2
WINDOW 3 32 56 VTop 2
SYMATTR InstName R13
SYMATTR Value 100k
SYMBOL res 528 3120 R90
WINDOW 0 0 56 VBottom 2
WINDOW 3 32 56 VTop 2
SYMATTR InstName R17
SYMATTR Value 100k
SYMBOL res 1568 1328 R0
SYMATTR InstName RL6
SYMATTR Value 100k
SYMBOL res 1696 1328 R0
SYMATTR InstName R2
SYMATTR Value 100k
SYMBOL res 1888 1360 R0
SYMATTR InstName R23
SYMATTR Value 2.2k
SYMBOL res 2160 1232 R0
SYMATTR InstName Rs5
SYMATTR Value 100k
SYMBOL cap 2160 1520 R0
SYMATTR InstName Cs5
SYMATTR Value 1µ
SYMBOL npn 1824 1184 R90
SYMATTR InstName Q13
SYMATTR Value 2N3904
SYMBOL pnp 1840 1264 R0
WINDOW 0 66 16 Left 2
WINDOW 3 65 65 Left 2
SYMATTR InstName Q14
SYMATTR Value 2N3906
SYMBOL npn 2128 1376 M0
SYMATTR InstName Q15
SYMATTR Value 2N3904
SYMBOL polcap 1440 1344 R0
SYMATTR InstName Cm6
SYMATTR Value 0.47µ
SYMBOL res 2016 1232 R0
SYMATTR InstName R24
SYMATTR Value 600
SYMBOL res 1424 1152 R90
WINDOW 0 0 56 VBottom 2
WINDOW 3 32 56 VTop 2
SYMATTR InstName R26
SYMATTR Value 50k
SYMBOL res 1424 1616 R90
WINDOW 0 0 56 VBottom 2
WINDOW 3 32 56 VTop 2
SYMATTR InstName R28
SYMATTR Value 100
TEXT -944 1344 Left 2 !.tran 0 1 0.01 0.001 startup
TEXT 3784 688 Left 5 ;ETAPA DE SUMATORIA - GENERACION \nDE POTENCIAL COMPUESTO
TEXT -1120 432 Left 7 ;GENERACIÓN DE POTENCIALES DE ACCIÓN COMPUESTO
TEXT 248 688 Left 5 ;AXONES
TEXT 3816 1640 Left 1 ;Aquí se colocan los interruptores
TEXT 144 1184 VRight 5 ;Axones tipo A
TEXT 144 1840 VRight 5 ;Axones tipo B
TEXT 144 2496 VRight 5 ;Axones tipo B
TEXT 144 3152 VRight 5 ;Axones tipo C
TEXT 256 792 Left 3 ;Las fibras nerviosas se clasifican en distintos tipos (Aalpha, Abeta, Asigma, Adelta; B, y C) de acuerdo\ncon su velocidad de conducción nerviosa y su función.
TEXT 2376 712 Left 5 ;ETAPA DE PROCESAMIENTO
TEXT 2376 816 Left 3 ;El modelo de FitzHugh-Nagumo presenta a la salida un potencial de acción \ncon una amplitud mayor a la que presentaría una membrana celular real. \nPor esto se implementó una etapa de procesamiento para reducir la amplitud \nde la señal y crear un offset tal que la señal se encuentre entre +40mV y -70mV \n(valores característicos de los potenciales de acción reales).
TEXT 3792 824 Left 3 ;Al estimular un nervio mixto (posee fibras nerviosas aferentes y eferentes)\nla contribución de todos los potenciales de acción que se generan en las \ndistintas fibras nerviosas conforman el potencial de acción compuesto.\nEste potencial puede medirse haciendo uso de un electrodo colocado a\nuna distancia determinada del punto de estimulación.
TEXT -1096 672 Left 5 ;FUENTES DE VOLTAJE EXTERNAS
TEXT -1088 744 Left 3 ;El modelo de nervio vago requiere de los siguientes voltajes.\n \nSegmento de axón:\n->   +12V      ->   -40mV      ->   Señal de estimulación\n \nEtapa de procesamiento:\n->   -60mV
TEXT -1096 1632 Left 5 ;FUENTES DE VOLTAJE +5V Y -12V
TEXT -1088 1704 Left 3 ;La fuente de voltaje de +5V se construyó con el fin de tener una\nfuente de alimentación para LEDs en el case del nervio vago.\n \nSe construyó un generador de voltaje de -12V para alimentar los \nopamps de la etapa de procesamiento y así generar la etapa de\nhiperpolarización del potencial de acción.
RECTANGLE Normal -16 3344 -1120 2688 1
RECTANGLE Normal 4896 1728 3760 1072 1
RECTANGLE Normal -16 2640 -1120 2048 1
RECTANGLE Normal -128 1392 -1120 1072 1
RECTANGLE Normal 2272 1728 208 1072 1
RECTANGLE Normal 4992 3792 -1168 576
RECTANGLE Normal 4048 1616 3824 1120 2
RECTANGLE Normal 208 1728 64 1072 1
RECTANGLE Normal 2272 2384 208 1728 1
RECTANGLE Normal 2272 3040 208 2384 1
RECTANGLE Normal 208 3040 64 2384 1
RECTANGLE Normal 2272 3696 208 3040 1
RECTANGLE Normal 208 3696 64 3040 1
RECTANGLE Normal 3696 1728 2336 1072 1
RECTANGLE Normal 3696 2384 2336 1728 1
RECTANGLE Normal 3696 3040 2336 2384 1
RECTANGLE Normal 3696 3696 2336 3040 1
RECTANGLE Normal 208 2384 64 1728 1
RECTANGLE Normal 4896 1024 3760 640 2
RECTANGLE Normal 3696 1024 2336 640 2
RECTANGLE Normal 2272 1024 208 640 2
RECTANGLE Normal 2016 528 -1168 336
RECTANGLE Normal -128 1024 -1120 624 2
RECTANGLE Normal -16 2000 -1120 1584 2

The netlist it stands for:
* Compound-Action-Potential.asc
XU2 0 +5V N030 LT1117-5
D1 +12V N030 1N4148
D3 N031 0 1N4148
R1 N031 +5V 330
RL1 OUT-N1 0 100k
R5 N008 0 100k
R6 N014 +12V 2.2k
Rs1 OUT-N1 N018 100k
Cs1 N018 0 1µ
Q1 N010 OUT-N1 N008 0 2N3904
Q2 OUT-N1 N010 N014 0 2N3906
Q3 N015 N018 -400mV 0 2N3904
Cm1 OUT-N1 0 0.47µ
R7 OUT-N1 N015 600
V3 -400mV 0 -400mV
C1 N030 0 47µ
C2 +5V 0 47µ
V5 N004 0 PWL(0 0 5m 0 5.0000001m 0.5 15m 0.5 15.000001m 0 70m 0 70.000001m 1 80m 1 80.000001m 0 135m 0 135.000001m 2 145m 2 145.000001m 0 200m 0 200.000001m 3 210m 3 210.000001m 0 265m 0 265.000001m 4 275m 4 275.000001m 0 330m 0 330.00001m 5 340m 5 340.000001m 0)
RL2 OUT-N2 0 100k
R9 N023 0 100k
R10 N027 +12V 2.2k
Rs2 OUT-N2 N029 150k
Cs2 N029 0 1µ
Q4 N024 OUT-N2 N023 0 2N3904
Q5 OUT-N2 N024 N027 0 2N3906
Q6 N028 N029 -400mV 0 2N3904
Cm2 OUT-N2 0 0.90µ
R11 OUT-N2 N028 600
RL4 OUT-N3 0 100k
R14 N033 0 100k
R15 N038 +12V 2.2k
Rs3 OUT-N3 N040 200k
Cs3 N040 0 1µ
Q7 N035 OUT-N3 N033 0 2N3904
Q8 OUT-N3 N035 N038 0 2N3906
Q9 N039 N040 -400mV 0 2N3904
Cm4 OUT-N3 0 1µ
R16 OUT-N3 N039 600
R18 N001 Vm-Acond-N1 1k
R19 N001 Vm-Acond-N2 4k
R20 N002 N001 1k
XU4 0 N001 +12V -12V N002 level2 Avol=1Meg GBW=10Meg Slew=10Meg Ilimit=25m Rail=0 Vos=0 En=0 Enk=0 In=0 Ink=0 Rin=500Meg  ; pins In+ In- V+ V- OUT
V4 +12V 0 12
XU5 0 N003 +12V -12V CAP level2 Avol=1Meg GBW=10Meg Slew=10Meg Ilimit=25m Rail=0 Vos=0 En=0 Enk=0 In=0 Ink=0 Rin=500Meg  ; pins In+ In- V+ V- OUT
R21 N003 N002 1k
R22 CAP N003 1k
R29 N001 Vm-Acond-N3 2k
R30 N001 Vm-Acond-N4 3k
XU3 OUT-N1 N006 +12V -12V N006 level2 Avol=1Meg GBW=10Meg Slew=10Meg Ilimit=25m Rail=0 Vos=0 En=0 Enk=0 In=0 Ink=0 Rin=500Meg  ; pins In+ In- V+ V- OUT
XU9 OUT-N3 N032 +12V -12V N032 level2 Avol=1Meg GBW=10Meg Slew=10Meg Ilimit=25m Rail=0 Vos=0 En=0 Enk=0 In=0 Ink=0 Rin=500Meg  ; pins In+ In- V+ V- OUT
XU10 OUT-N2 N021 +12V -12V N021 level2 Avol=1Meg GBW=10Meg Slew=10Meg Ilimit=25m Rail=0 Vos=0 En=0 Enk=0 In=0 Ink=0 Rin=500Meg  ; pins In+ In- V+ V- OUT
XU11 OUT-N4 N045 +12V -12V N045 level2 Avol=1Meg GBW=10Meg Slew=10Meg Ilimit=25m Rail=0 Vos=0 En=0 Enk=0 In=0 Ink=0 Rin=500Meg  ; pins In+ In- V+ V- OUT
RL5 OUT-N4 0 1Meg
R3 N047 0 100k
R4 N051 +12V 2.2k
Rs4 OUT-N4 N053 100k
Cs4 N053 0 1µ
Q10 N048 OUT-N4 N047 0 2N3904
Q11 OUT-N4 N048 N051 0 2N3906
Q12 N052 N053 -400mV 0 2N3904
Cm5 OUT-N4 0 1.2µ
R25 OUT-N4 N052 600
V1 STIM 0 PULSE(0 5 0 1f 1f 10m 140m 0)
XU14 0 N049 +12V -12V N050 level1 Avol=1Meg GBW=10Meg Vos=0 En=0 Enk=0 In=0 Ink=0 Rin=500Meg  ; pins In+ In- V+ V- OUT
R36 N049 N045 100k
R37 N049 -60mV 1k
R38 N050 N049 1k
XU15 0 N025 +12V -12V N026 level1 Avol=1Meg GBW=10Meg Vos=0 En=0 Enk=0 In=0 Ink=0 Rin=500Meg  ; pins In+ In- V+ V- OUT
R39 N025 N021 100k
R40 N025 -60mV 1k
R41 N026 N025 1k
XU16 0 N036 +12V -12V N037 level1 Avol=1Meg GBW=10Meg Vos=0 En=0 Enk=0 In=0 Ink=0 Rin=500Meg  ; pins In+ In- V+ V- OUT
R42 N036 N032 100k
R43 N036 -60mV 1k
R44 N037 N036 1k
XU17 0 N012 +12V -12V N013 level1 Avol=1Meg GBW=10Meg Vos=0 En=0 Enk=0 In=0 Ink=0 Rin=500Meg  ; pins In+ In- V+ V- OUT
R45 N012 N006 100k
R46 N012 -60mV 1k
R47 N013 N012 1k
XU19 0 N046 +12V -12V Vm-Acond-N4 level1 Avol=1Meg GBW=10Meg Vos=0 En=0 Enk=0 In=0 Ink=0 Rin=500Meg  ; pins In+ In- V+ V- OUT
R48 N046 N050 1k
R49 Vm-Acond-N4 N046 1k
XU20 0 N022 +12V -12V Vm-Acond-N2 level1 Avol=1Meg GBW=10Meg Vos=0 En=0 Enk=0 In=0 Ink=0 Rin=500Meg  ; pins In+ In- V+ V- OUT
R50 N022 N026 1k
R51 Vm-Acond-N2 N022 1k
XU21 0 N034 +12V -12V Vm-Acond-N3 level1 Avol=1Meg GBW=10Meg Vos=0 En=0 Enk=0 In=0 Ink=0 Rin=500Meg  ; pins In+ In- V+ V- OUT
R52 N034 N037 1k
R53 Vm-Acond-N3 N034 1k
XU22 0 N007 +12V -12V Vm-Acond-N1 level1 Avol=1Meg GBW=10Meg Vos=0 En=0 Enk=0 In=0 Ink=0 Rin=500Meg  ; pins In+ In- V+ V- OUT
R54 N007 N013 1k
R55 Vm-Acond-N1 N007 1k
XU18 0 N041 N043 +12V NC_01 N041 N042 +12V NE555  ; pins GND TRIG OUT RST CV THRS DIS Vcc
R27 +12V N042 2k
R35 N042 N041 10k
C6 +12V 0 10µ
C8 N043 N044 4.7µ
C10 0 -12V 4.7µ
D6 N044 0 1N4148
D7 -12V N044 1N4148
C11 N041 0 100n
V2 -60mV 0 -60mV
R8 OUT-N1 STIM 100k
R12 OUT-N2 STIM 100k
R13 OUT-N3 STIM 100k
R17 OUT-N4 STIM 100k
RL6 N005 N020 100k
R2 N009 N020 100k
R23 N016 +12V 2.2k
Rs5 N005 N019 100k
Cs5 N019 N020 1µ
Q13 N011 N005 N009 0 2N3904
Q14 N005 N011 N016 0 2N3906
Q15 N017 N019 -400mV 0 2N3904
Cm6 N005 N020 0.47µ
R24 N005 N017 600
R26 N005 OUT-N1 50k
R28 N020 0 100
.model D D
.lib standard.dio
.model NPN NPN
.model PNP PNP
.lib standard.bjt
.tran 0 1 0.01 0.001 startup
* ETAPA DE SUMATORIA - GENERACION
* DE POTENCIAL COMPUESTO
* GENERACIÓN DE POTENCIALES DE ACCIÓN COMPUESTO
* AXONES
* Aquí se colocan los interruptores
* Axones tipo A
* Axones tipo B
* Axones tipo B
* Axones tipo C
* Las fibras nerviosas se clasifican en distintos tipos (Aalpha, Abeta, Asigma, Adelta; B, y C) de acuerdo
* con su velocidad de conducción nerviosa y su función.
* ETAPA DE PROCESAMIENTO
* El modelo de FitzHugh-Nagumo presenta a la salida un potencial de acción
* con una amplitud mayor a la que presentaría una membrana celular real.
* Por esto se implementó una etapa de procesamiento para reducir la amplitud
* de la señal y crear un offset tal que la señal se encuentre entre +40mV y -70mV
* (valores característicos de los potenciales de acción reales).
* Al estimular un nervio mixto (posee fibras nerviosas aferentes y eferentes)
* la contribución de todos los potenciales de acción que se generan en las
* distintas fibras nerviosas conforman el potencial de acción compuesto.
* Este potencial puede medirse haciendo uso de un electrodo colocado a
* una distancia determinada del punto de estimulación.
* FUENTES DE VOLTAJE EXTERNAS
* El modelo de nervio vago requiere de los siguientes voltajes.
* Segmento de axón:
* ->   +12V      ->   -40mV      ->   Señal de estimulación
* Etapa de procesamiento:
* ->   -60mV
* FUENTES DE VOLTAJE +5V Y -12V
* La fuente de voltaje de +5V se construyó con el fin de tener una
* fuente de alimentación para LEDs en el case del nervio vago.
* Se construyó un generador de voltaje de -12V para alimentar los
* opamps de la etapa de procesamiento y así generar la etapa de
* hiperpolarización del potencial de acción.
.lib UniversalOpAmp2.lib
.lib UniversalOpAmp1.lib
.lib NE555.sub
.backanno
.end